# Altium schematic sheet Main.SchDoc: Main
size A4; DrawnBy: Ian Glass; Engineer: Ian Glass; Address1: Auckland Bioengineering; Address2: Institute; Address3: Auckland 1010; Address4: New Zealand; Revision: 1; SheetNumber: 1; SheetTotal: 4
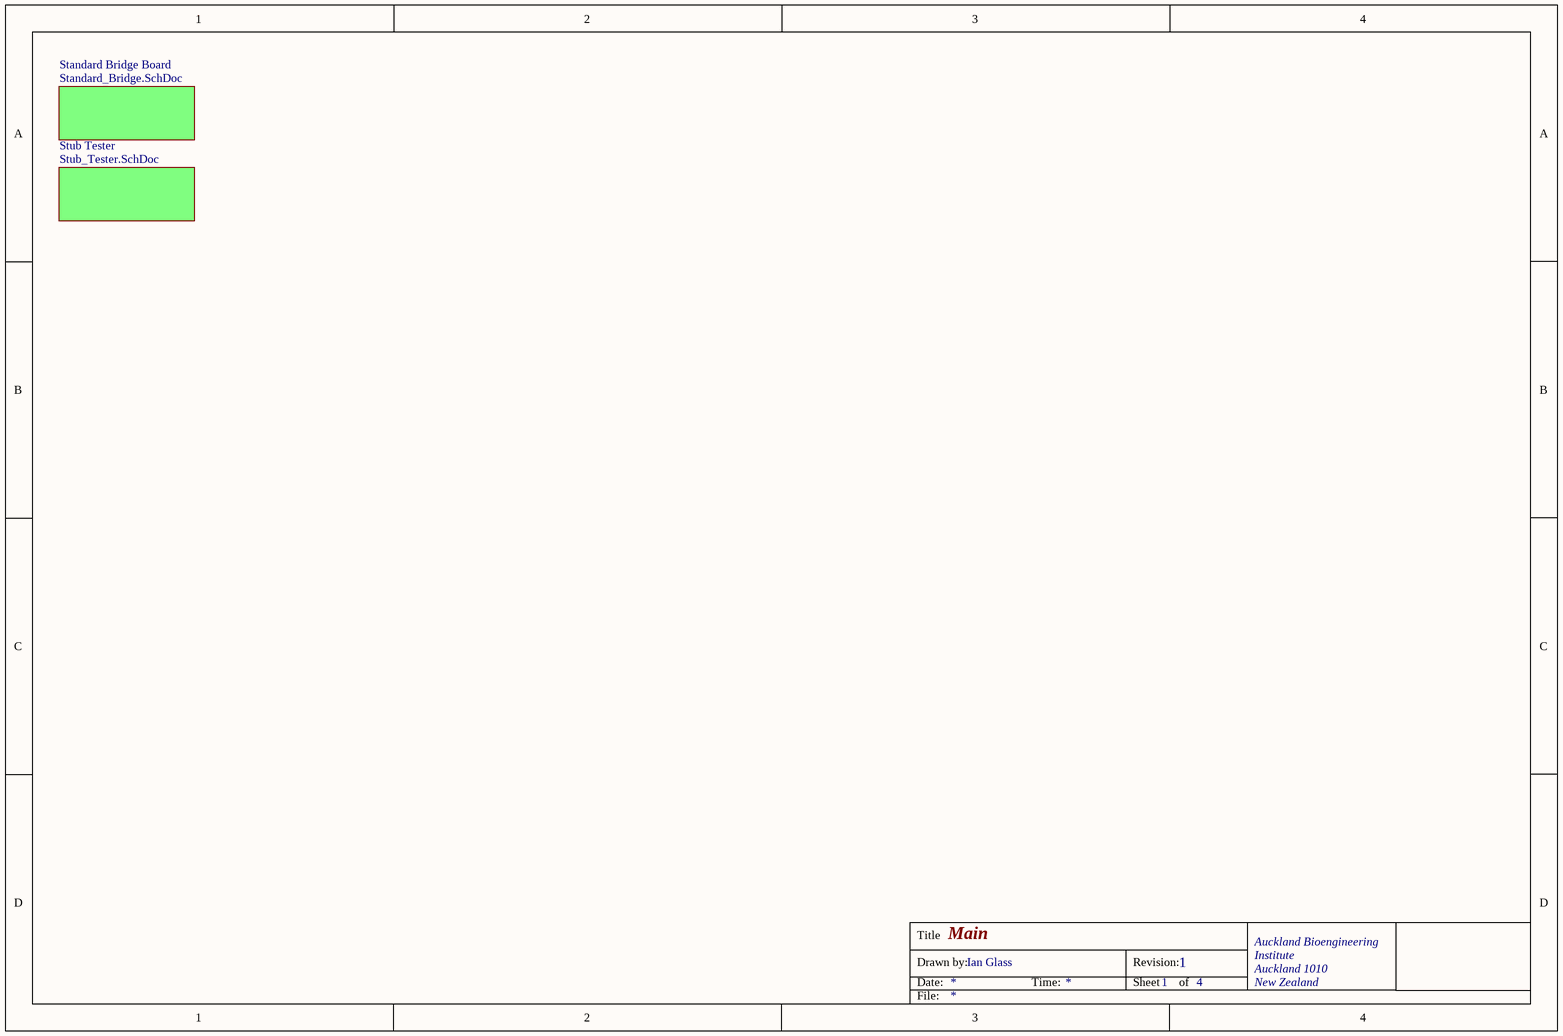
[diagram p0: Main.SchDoc]

## Sub-sheets
Standard Bridge Board = Standard_Bridge.SchDoc: no entries
Stub Tester = Stub_Tester.SchDoc: no entries

## Notes on the sheet
- Title
- Drawn by:
- Date:
- Time:
- Revision:
- Sheet
- of
- File: